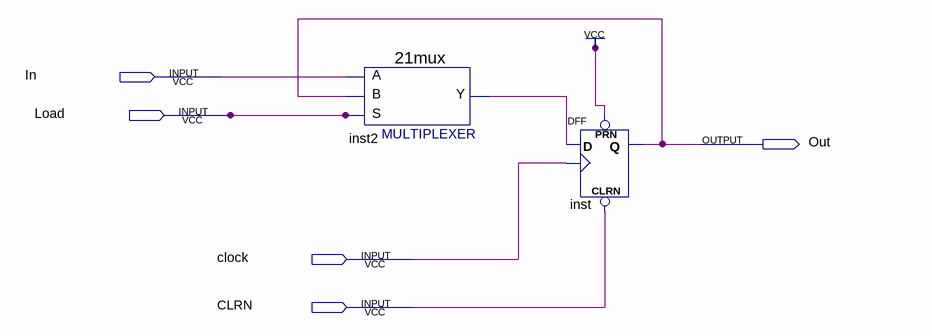
[diagram p0: schematic sheet]
// Quartus schematic register.bdf as structural Verilog: 2 symbols, 5 pins
module register (
  input  In,
  input  Load,
  input  clock,
  input  CLRN,
  output Out
);

  wire inst2_y;

  \21mux  inst2 (.S(Load), .B(Out), .A(In), .Y(inst2_y));
  DFF inst (.CLRN(CLRN), .CLK(clock), .D(inst2_y), .PRN(1'b1), .Q(Out));
endmodule
